# Altium schematic sheet CAN.SchDoc: QUTMS Shutdown V2 - CANBUS
size A4; Author: Jonn Dillon; Organization: QUT Motorsport; Address1: O-120; Address2: O Block; Address3: QUT Gardens Point; Address4: Brisbane, 4000; DocumentNumber: 7; SheetNumber: 7; SheetTotal: 10
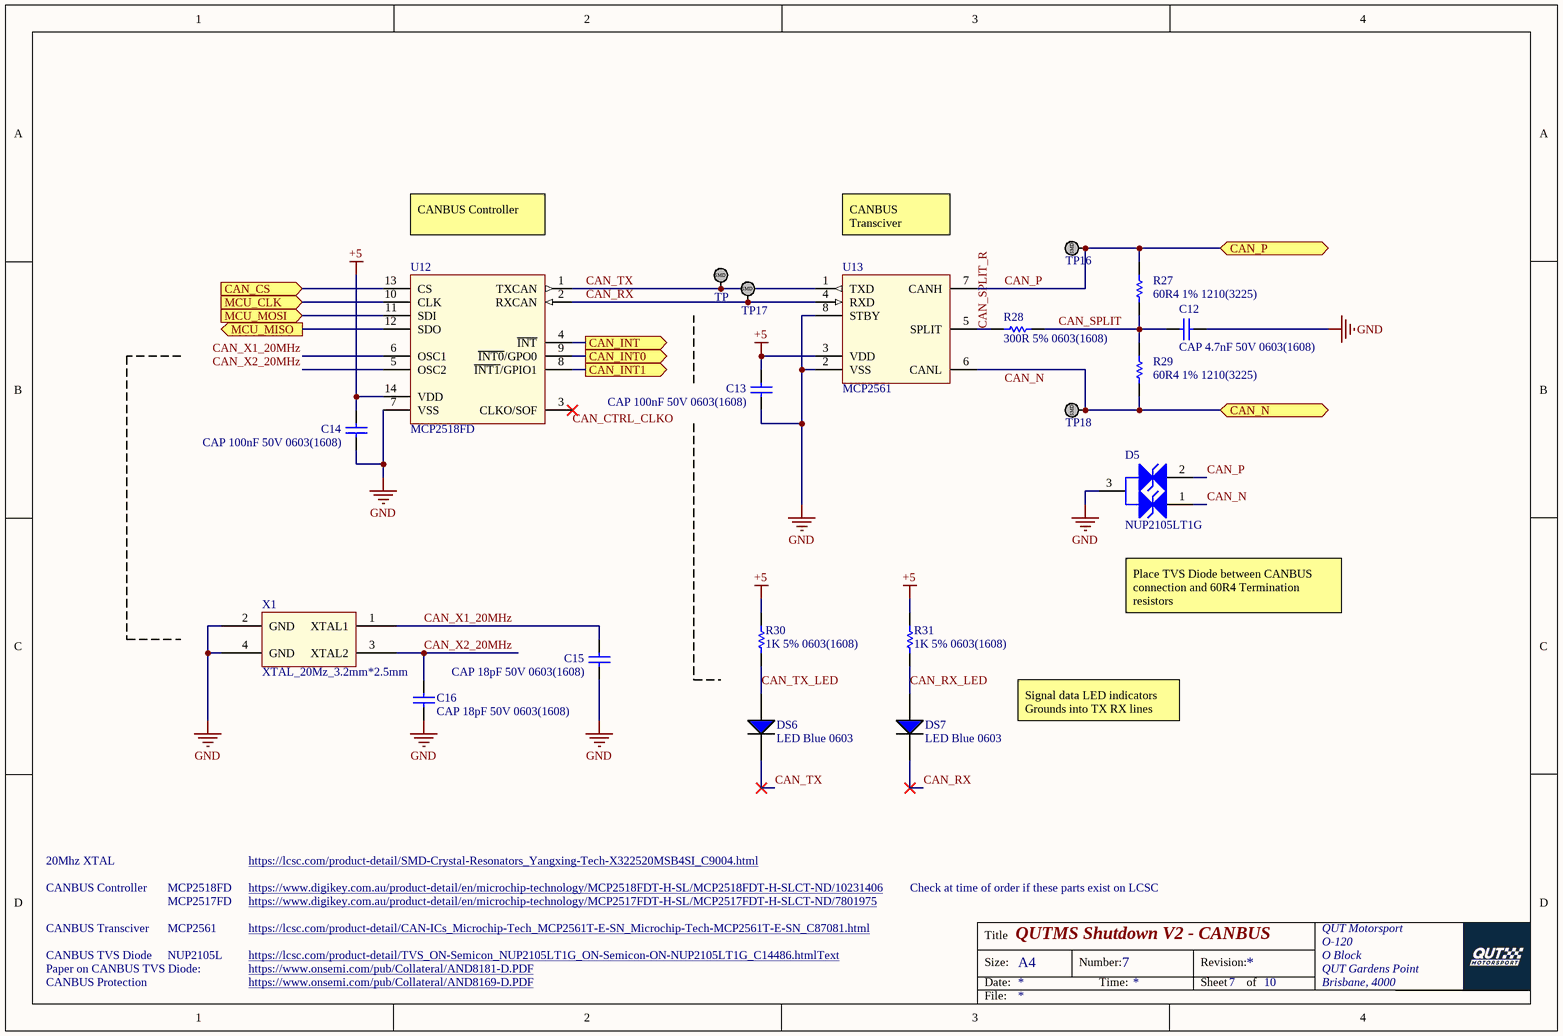
[diagram p0: CAN.SchDoc]

## Parts
C12  CAP 4.7nF 50V 0603(1608)  [CAPC0603(1608)100_M]
C13  CAP 100nF 50V 0603(1608)  [CAPC0603(1608)100_L]
C14  CAP 100nF 50V 0603(1608)  [CAPC0603(1608)100_L]
C15  CAP 18pF 50V 0603(1608)  [CAPC0603(1608)100_L]
C16  CAP 18pF 50V 0603(1608)  [CAPC0603(1608)100_L]
D5  NUP2105LT1G  [ONSC-SOT-23-3-318-08_V]
DS6  LED Blue 0603  [LED BLUE 0603]
DS7  LED Blue 0603  [LED BLUE 0603]
R27  60R4 1% 1210(3225)  [RESC1210(3225)_L]
R28  300R 5% 0603(1608)  [RESC0603(1608)_N]
R29  60R4 1% 1210(3225)  [RESC1210(3225)_L]
R30  1K 5% 0603(1608)  [RESC0603(1608)_L]
R31  1K 5% 0603(1608)  [RESC0603(1608)_L]
TP  TestPoint_SMD  [TestPointSMD]  (value not drawn)
TP16  TestPoint_SMD  [TestPointSMD]  (value not drawn)
TP17  TestPoint_SMD  [TestPointSMD]  (value not drawn)
TP18  TestPoint_SMD  [TestPointSMD]  (value not drawn)
U12  MCP2518FD  [MCP2517FD SOIC]
U13  MCP2561  [MCP2561 SOIC]
X1  XTAL_20Mz_3.2mm*2.5mm  [3.2mm*2.5mm]

## Ports
CAN_CS (in), CAN_INT0 (out), CAN_INT1 (out), CAN_INT (out), CAN_N (bidir), CAN_P (bidir), MCU_CLK (in), MCU_MISO (out), MCU_MOSI (in)

## Nets
+5: C13.2 C14.2 R30.2 R31.2 U12.14(VDD) U13.3(VDD)
GND: C12.1 C13.1 C14.1 C15.1 C16.1 D5.3(K) U12.7(VSS) U13.2(VSS) U13.8(STBY) X1.2(GND) X1.4(GND)
CAN_CS: U12.13(CS) ; port CAN_CS
CAN_CTRL_CLKO: U12.3(CLKO/SOF)
CAN_INT: U12.4(~{INT}) ; port CAN_INT
CAN_INT0: U12.9(~{INT0}/GPO0) ; port CAN_INT0
CAN_INT1: U12.8(~{INT1}/GPIO1) ; port CAN_INT1
CAN_N: D5.1(K) R29.1 TP18.1 U13.6(CANL) ; port CAN_N
CAN_P: D5.2(K) R27.2 TP16.1 U13.7(CANH) ; port CAN_P
CAN_RX: DS7.2(C) TP17.1 U12.2(RXCAN) U13.4(RXD)
CAN_RX_LED: DS7.1(A) R31.1
CAN_SPLIT: C12.2 R27.1 R28.2 R29.2
CAN_SPLIT_R: R28.1 U13.5(SPLIT)
CAN_TX: DS6.2(C) TP.1 U12.1(TXCAN) U13.1(TXD)
CAN_TX_LED: DS6.1(A) R30.1
CAN_X1_20MHz: C15.2 U12.6(OSC1) X1.1(XTAL1)
CAN_X2_20MHz: C16.2 U12.5(OSC2) X1.3(XTAL2)
MCU_CLK: U12.10(CLK) ; port MCU_CLK
MCU_MISO: U12.12(SDO) ; port MCU_MISO
MCU_MOSI: U12.11(SDI) ; port MCU_MOSI

## Notes on the sheet
- CANBUS Controller
- CANBUS Transciver
- Place TVS Diode between CANBUS connection and 60R4 Termination resistors
- Signal data LED indicators
  Grounds into TX RX lines
- 20Mhz XTAL
- MCP2518FD
- MCP2517FD
- https://www.digikey.com.au/product-detail/en/microchip-technology/MCP2518FDT-H-SL/MCP2518FDT-H-SLCT-ND/10231406
- https://www.digikey.com.au/product-detail/en/microchip-technology/MCP2517FDT-H-SL/MCP2517FDT-H-SLCT-ND/7801975
- https://lcsc.com/product-detail/SMD-Crystal-Resonators_Yangxing-Tech-X322520MSB4SI_C9004.html
- Check at time of order if these parts exist on LCSC
- Paper on CANBUS TVS Diode:
- CANBUS TVS Diode
- CANBUS Protection
- MCP2561
- NUP2105L
- https://www.onsemi.com/pub/Collateral/AND8181-D.PDF
- https://lcsc.com/product-detail/CAN-ICs_Microchip-Tech_MCP2561T-E-SN_Microchip-Tech-MCP2561T-E-SN_C87081.html
- https://lcsc.com/product-detail/TVS_ON-Semicon_NUP2105LT1G_ON-Semicon-ON-NUP2105LT1G_C14486.htmlText
- https://www.onsemi.com/pub/Collateral/AND8169-D.PDF
- Title
- Size:
- Date:
- A4
- Number:
- Time:
- Revision:
- Sheet
- of
- File:
- (in symbol TestPoint_SMD) SMD

## Library data of the parts
C12 = CMP-1035-02202-1: CAP 4.7nF 50V ±5% 0603 (1608 Metric) Thickness 1mm SMD; Case-Metric: 1608; Case-EIA: 0603; Tolerance: Â±5%; Value: 4.7nF; Rated Voltage: 50 V; Technology: SMT; Max Thickness: 1 mm
C13 C14 = CMP-1035-02591-1: CAP 100nF 50V ±5% 0603 (1608 Metric) Thickness 1mm SMD; Tolerance: Â±5%; Case-Metric: 1608; Case-EIA: 0603; Rated Voltage: 50 V; Max Thickness: 1 mm; Technology: SMT; Value: 100nF
C15 C16 = CMP-1035-00748-1: CAP 18pF 50V ±1% 0603 (1608 Metric) Thickness 1mm SMD; Case-EIA: 0603; Case-Metric: 1608; Tolerance: Â±1%; Max Thickness: 1 mm; Value: 18pF; Rated Voltage: 50 V; Technology: SMT
D5 = CMP-1063-00164-1: Dual Line CAN Bus Protector, 3-Pin SOT-23, Pb-Free, Tape and Reel; Manufacturer: On Semiconductor; IR Max (uA): 0.1; Number of Lines: 2; Direction: Bidirectional; C Max (pF): 30; PPK Max (W): 350; V(BR) Min (V): 26.2; ComponentLink3URL: http://www.onsemi.cn/pub_link/Collateral/318-08.PDF; Mounting Technology: Surface Mount; ComponentLink2Description: Datasheet; PartNumber: NUP2105LT1G; ComponentLink1URL: http://www.onsemi.com/; PackageVersion: Rev. AP, 11/2009; DatasheetVersion: Rev. 5; RoHS: Pb-Free; PackageReference: SOT-23-3-318-08; ComponentLink2URL: http://www.onsemi.cn/pub_link/Collateral/NUP2105L-D.PDF; ComponentLink1Description: Manufacturer URL; PackageDescription: 3-Pin Small Outline Transistor, Body 2.92 x 1.3 mm, Pitch 0.95 mm; Packing: Tape and Reel; ComponentLink3Description: Package Specification
R27 R29 = CMP-1015-00372-1: 60R4 0.5W 1% 1210 (3225 Metric)  SMD; Case-Metric: 3225; Case-EIA: 1210; Value: 60.40 Ohm; Technology: SMT; Tolerance: 1 %; Power: 0.5 W
R28 = CMP-1012-00061-1: 300R 0.1W 5% 0603 (1608 Metric)  SMD; Case-EIA: 0603; Value: 300.00 Ohm; Case-Metric: 1608; Tolerance: 5 %; Power: 0.1 W; Technology: SMT
R30 R31 = CMP-1012-00074-1: 1K 0.1W 5% 0603 (1608 Metric)  SMD; Case-EIA: 0603; Case-Metric: 1608; Value: 1000.00 Ohm; Technology: SMT; Tolerance: 5 %; Power: 0.1 W
X1 = XTAL_20Mz_3.2mm*2.5mm: ComponentLink1Description: LCSC; ComponentLink1URL: https://lcsc.com/product-detail/SMD-Crystal-Resonators_Yangxing-Tech-X322520MSB4SI_C9004.html